# EAGLE schematic new_full (EAGLE 6.6.0)
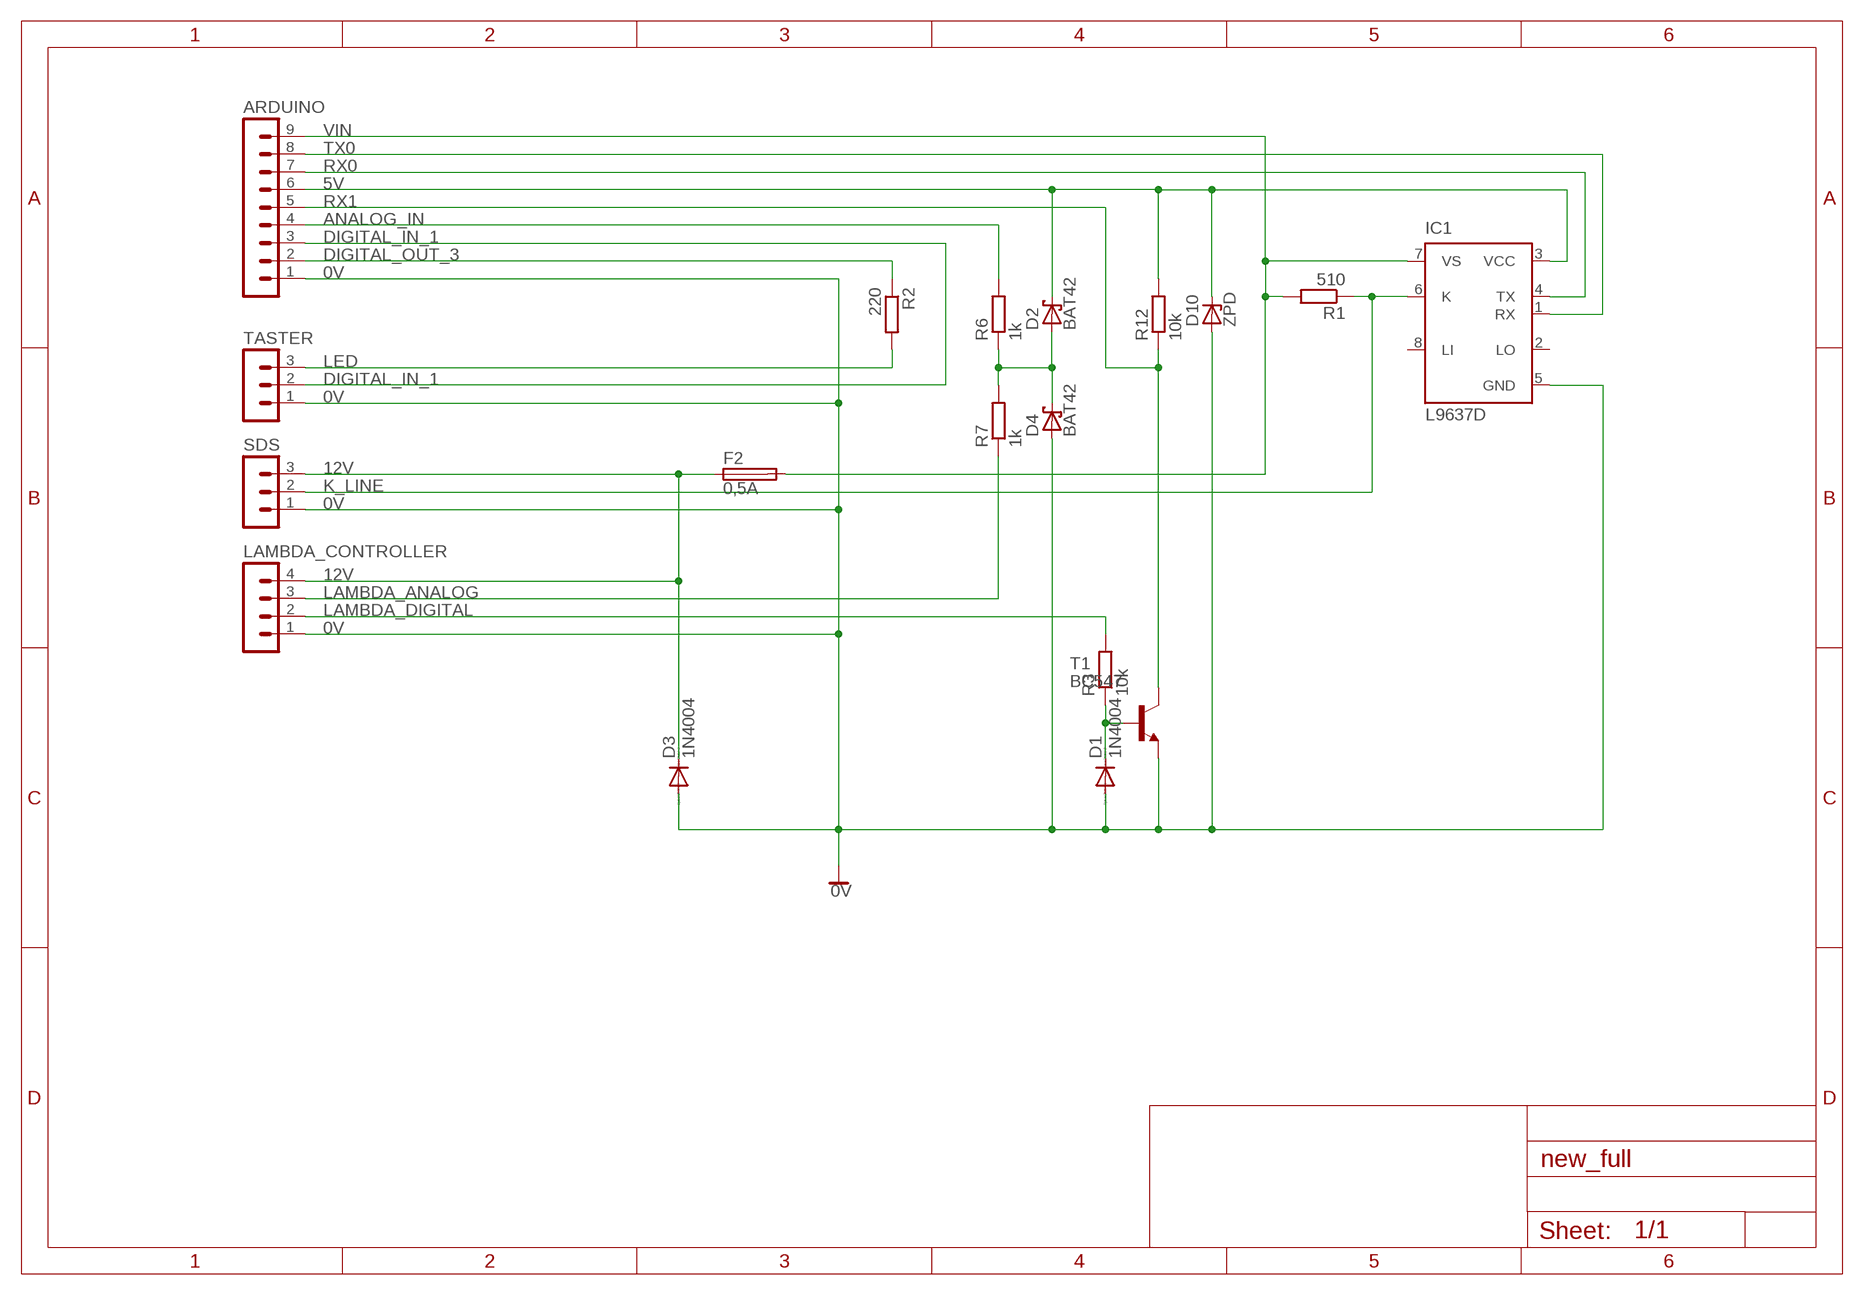
[diagram p0: schematic, sheet 1]

## Parts
ARDUINO  MA09-1  [MA09-1]
D1  1N4004  [DO41-10]
D2  BAT42  [DO35-10]
D3  1N4004  [DO41-10]
D4  BAT42  [DO35-10]
D10  ZPD  [DO35Z10]
F2  0,5A  SH22,5  [SH22,5]
IC1  L9637D  [SO08]
LAMBDA_CONTROLLER  MA04-1  [MA04-1]
R1  510  R-EU_0207/7  [0207/7]
R2  220  R-EU_0207/7  [0207/7]
R3  10k  R-EU_0207/7  [0207/7]
R6  1k  R-EU_0207/7  [0207/7]
R7  1k  R-EU_0207/7  [0207/7]
R12  10k  R-EU_0207/7  [0207/7]
SDS  MA03-1  [MA03-1]
T1  BC547  [TO92]
TASTER  MA03-1  [MA03-1]

## Nets
0V: ARDUINO.1 D1.A D3.A D4.A D10.A IC1.5(GND) LAMBDA_CONTROLLER.1 SDS.1 T1.1(E) TASTER.1
5V: ARDUINO.6 D2.C D10.C IC1.3(VCC) R12.2
12V: D3.C F2.1 LAMBDA_CONTROLLER.4 SDS.3
ANALOG_IN: ARDUINO.4 D2.A D4.C R6.1 R6.2 R7.2
DIGITAL_IN_1: ARDUINO.3 TASTER.2
DIGITAL_OUT_3: ARDUINO.2 R2.1
K_LINE: IC1.6(K) R1.1 SDS.2
LAMBDA_ANALOG: LAMBDA_CONTROLLER.3 R7.1
LAMBDA_DIGITAL: LAMBDA_CONTROLLER.2 R3.2
LED: R2.2 TASTER.3
N$1: D1.C R3.1 T1.2(B)
RX0: ARDUINO.7 IC1.4(TX)
RX1: ARDUINO.5 R12.1 T1.3(C)
TX0: ARDUINO.8 IC1.1(RX)
VIN: ARDUINO.9 F2.2 IC1.7(VS) R1.2
Unconnected: IC1.2(LO) IC1.8(LI)

## Library data of the parts
ARDUINO = con-lstb:MA09-1: PIN HEADER; OC_FARNELL: unknown; OC_NEWARK: unknown
D1 D3 = diode:1N4004: DIODE general purpose rectifier, 1 A
D2 D4 = diode:BAT42: DIODE barrier diode
D10 = diode:ZPD: Z DIODE 500 mW
F2 = fuse:SH22,5: FUSE HOLDER grid 22,5 mm, OGN0031 8201, Schurter (Buerklin); MF: SCHURTER; MPN: 0031.8201; OC_FARNELL: 1162740; OC_NEWARK: 96F8317
IC1 = st-microelectronics:L9637D: ISO 9141 INTERFACE Source: 1765.pdf; MPN: L9637D; OC_FARNELL: unknown; OC_NEWARK: 56P8926
LAMBDA_CONTROLLER = con-lstb:MA04-1: PIN HEADER; OC_FARNELL: unknown; OC_NEWARK: unknown
R1-R3 R6 R7 R12 = rcl:R-EU_: RESISTOR, European symbol
SDS TASTER = con-lstb:MA03-1: PIN HEADER; OC_FARNELL: unknown; OC_NEWARK: unknown
T1 = transistor:BC547: NPN TRANSISTOR